# Altium schematic sheet CAN.SchDoc
size A4
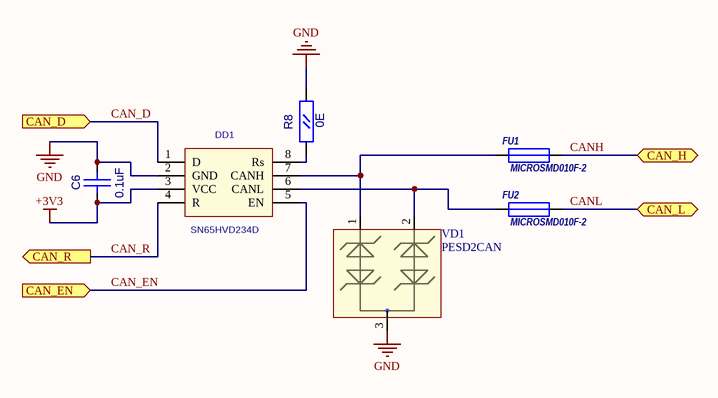
[diagram p0: CAN.SchDoc]

## Parts
C6  0.1uF  [CC0603]
DD1  SN65HVD234D  [SO-8]
FU1  MICROSMD010F-2  [RC1210]
FU2  MICROSMD010F-2  [RC1210]
R8  0E  [RC0603]
VD1  PESD2CAN  [SOT-23(123)]

## Ports
CAN_D (in), CAN_EN (in), CAN_H (bidir), CAN_L (bidir), CAN_R (out)

## Nets
+3V3: C6.1(A) DD1.3(VCC)
GND: C6.2(B) DD1.2(GND) R8.2(B) VD1.3
CAN_D: DD1.1(D) ; port CAN_D
CAN_EN: DD1.5(EN) ; port CAN_EN
CAN_R: DD1.4(R) ; port CAN_R
CANH: FU1.2 ; port CAN_H
CANL: FU2.2 ; port CAN_L
NetDD1_6: DD1.6(CANL) FU2.1 VD1.2
NetDD1_7: DD1.7(CANH) FU1.1 VD1.1
NetDD1_8: DD1.8(Rs) R8.1(A)

## Library data of the parts
C6 = CC0603: Value: 0.1uF
DD1 = SN65HVD234D: CAN Transceiver; Value: *
FU1 FU2 = MICROSMD: Value: MICROSMD010F-2
R8 = RC0603: Value: 0E
VD1 = PESD2CAN: TVS for CAN